# EAGLE design nrfdongle (EAGLE 6.2)
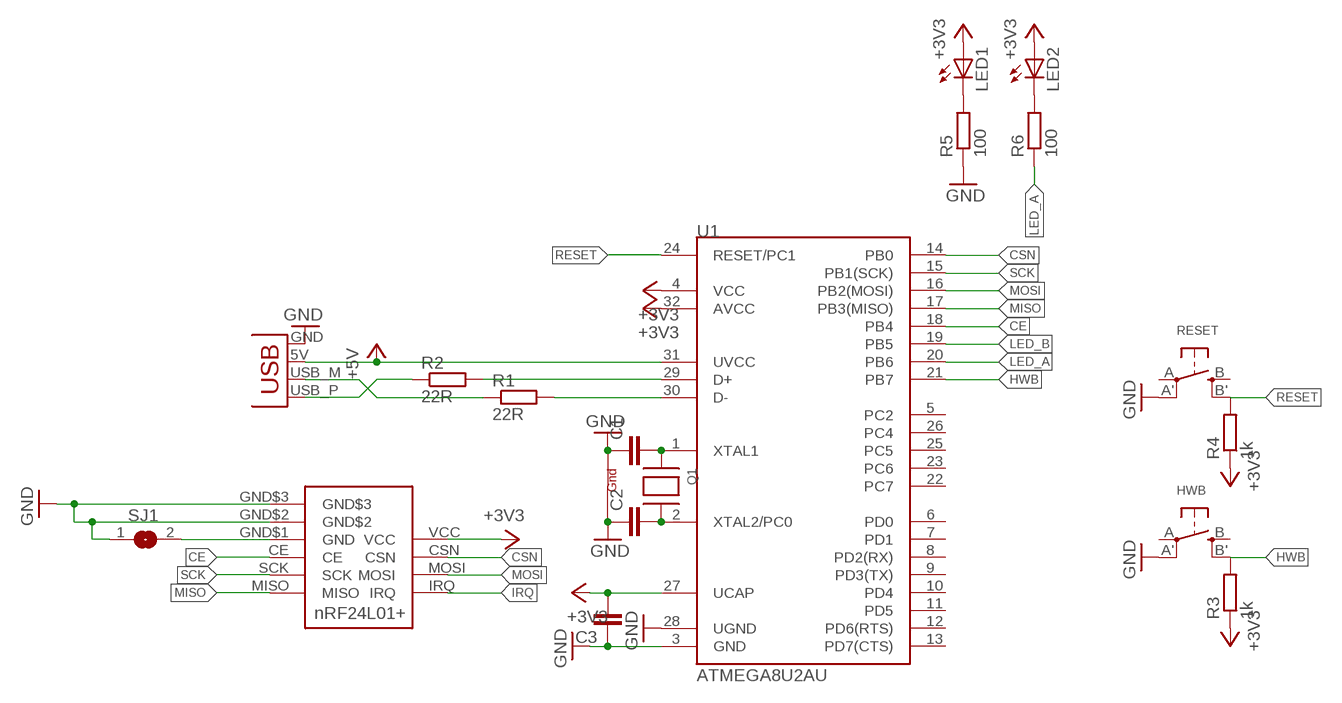
[diagram p0: schematic, sheet 1]

## Parts
C1  C-EUC0805  [C0805]
C2  C-EUC0805  [C0805]
C3  C-EUC0805  [C0805]
CHINESE1  NRF24L01+CHINESE-DUAL  [CHINESE-DUALPINOUT]
HWB  SWITCH_TACT_SMT  [EVQ-Q2]
LED1  LEDSML0805  [SML0805]
LED2  LEDSML0805  [SML0805]
Q1  XTAL-4-3225  [NX3225]
R1  22R  R-EU_R0805  [R0805]
R2  22R  R-EU_R0805  [R0805]
R3  1k  R-EU_R0805  [R0805]
R4  1k  R-EU_R0805  [R0805]
R5  100  R-EU_R0805  [R0805]
R6  100  R-EU_R0805  [R0805]
RESET  SWITCH_TACT_SMT  [EVQ-Q2]
SJ1  SJ  [SJ]
U1  ATMEGA8U2AU  [TQFP32-08]
X1  USBPCB  [USB-A-PCB]

## Nets
+3V3: C3.2 CHINESE1.VCC LED1.A LED2.A R3.1 R4.1 U1.4(VCC) U1.27(UCAP) U1.32(AVCC)
+5V: U1.31(UVCC) X1.5V(VBUS)
CE: CHINESE1.CE U1.18(PB4)
CSN: CHINESE1.CSN U1.14(PB0)
GND: C1.1 C2.1 C3.1 CHINESE1.GND$2 CHINESE1.GND$3 HWB.A'(P1) Q1.2(G1) Q1.4(G2) R5.1 RESET.A'(P1) SJ1.1 U1.3(GND) U1.28(UGND) X1.GND
HWB: HWB.B'(S1) R3.2 U1.21(PB7)
IRQ: CHINESE1.IRQ
LED_A: R6.1 U1.20(PB6)
LED_B: U1.19(PB5)
MISO: CHINESE1.MISO U1.17(PB3(MISO))
MOSI: CHINESE1.MOSI U1.16(PB2(MOSI))
N$1: R1.1 X1.USB_M(D-)
N$2: R2.1 X1.USB_P(D+)
N$3: R1.2 U1.30(D-)
N$4: R2.2 U1.29(D+)
N$5: CHINESE1.GND$1(GND) SJ1.2
N$6: C1.2 Q1.1(X1) U1.1(XTAL1)
N$7: C2.2 Q1.3(X2) U1.2(XTAL2/PC0)
N$8: LED1.C R5.2
N$9: LED2.C R6.2
RESET: R4.2 RESET.B'(S1) U1.24(RESET/PC1)
SCK: CHINESE1.SCK U1.15(PB1(SCK))
Unconnected: HWB.A(P) HWB.B(S) RESET.A(P) RESET.B(S) U1.5(PC2) U1.6(PD0) U1.7(PD1) U1.8(PD2(RX)) U1.9(PD3(TX)) U1.10(PD4) U1.11(PD5) U1.12(PD6(RTS)) U1.13(PD7(CTS)) U1.22(PC7) U1.23(PC6) U1.25(PC5) U1.26(PC4)

## Library data of the parts
C1-C3 = rcl:C-EU: CAPACITOR, European symbol
CHINESE1 = nrf24l01+:NRF24L01+: When using the DUAL version of this library, make sure to not connect pin 1 if you are using the 10 pin module.
HWB RESET = microbuilder:SWITCH_TACT_SMT: SMT Tact Switches 6x6mm - Digikey: P12940SCT-ND KMR2 (4.6x2.8mm) - Digikey: 401-1426-1-ND EVQ-PQHB55 - Light Touch, 160GF (4.5x4.5mm) - Digikey: P8090SCT-ND
LED1 LED2 = led:LED: LED OSRAM: - CHIPLED LG R971, LG N971, LY N971, LG Q971, LY Q971, LO R971, LY R971 LH N974, LH R974 LS Q976, LO Q976, LY Q976 LO Q996 - Hyper CHIPLED LW Q18S LB Q993, LB Q99A, LB R99A - SideLED LS A670, LO A670, LY A670, LG A670, LP A670 LB A673, LV A673, LT A673, LW A673 LH A674 LY A675 LS A676, LA A676, LO A676, LY A676, LW A676 LS A679, LY A679, LG A679 - Hyper Micro SIDELED® LS Y876, LA Y876, LO Y876, LY Y876 LT Y87S - SmartLED LW L88C, LW L88S LB L89C, LB L89S, LG L890 LS L89K, LO L89K, LY L89K LS L896, LA L896, LO L896, LY L896 - TOPLED LS T670, LO T670, LY T670, LG T670, LP T670 LSG T670, LSP T670, LSY T670, LOP T670, LYG T670 LG T671, LOG T671, LSG T671 LB T673, LV T673, LT T673, LW T673 LH T674 LS T676, LA T676, LO T676, LY T676, LB T676, LH T676, LSB T676, LW T676 LB T67C, LV T67C, LT T67C, LS T67K, LO T67K, LY T67K, LW E67C LS E67B, LA E67B, LO E67B, LY E67B, LB E67C, LV E67C, LT E67C LW T67C LS T679, LY T679, LG T679 LS T770, LO T770, LY T770, LG T770, LP T770 LB T773, LV T773, LT T773, LW T773 LH T774 LS E675, LA E675, LY E675, LS T675 LS T776, LA T776, LO T776, LY T776, LB T776 LHGB T686 LT T68C, LB T68C - Hyper Mini TOPLED® LB M676 - Mini TOPLED Santana® LG M470 LS M47K, LO M47K, LY M47K Source: http://www.osram.convergy.de LUXEON: - LUMILED® LXK2-PW12-R00, LXK2-PW12-S00, LXK2-PW14-U00, LXK2-PW14-V00 LXK2-PM12-R00, LXK2-PM12-S00, LXK2-PM14-U00 LXK2-PE12-Q00, LXK2-PE12-R00, LXK2-PE12-S00, LXK2-PE14-T00, LXK2-PE14-U00 LXK2-PB12-K00, LXK2-PB12-L00, LXK2-PB12-M00, LXK2-PB14-N00, LXK2-PB14-P00, LXK2-PB14-Q00 LXK2-PR12-L00, LXK2-PR12-M00, LXK2-PR14-Q00, LXK2-PR14-R00 LXK2-PD12-Q00, LXK2-PD12-R00, LXK2-PD12-S00 LXK2-PH12-R00, LXK2-PH12-S00 LXK2-PL12-P00, LXK2-PL12-Q00, LXK2-PL12-R00 Source: www.luxeon.com KINGBRIGHT: KA-3528ASYC Source: www.kingbright.com
Q1 = adafruit:XTAL-4: Classic 4-pin 3.2 x 2.5mm crystal
R1-R6 = rcl:R-EU_: RESISTOR, European symbol
SJ1 = jumper:SJ: SMD solder JUMPER
U1 = SparkFun:ATMEGA8U2: Atmel 8-bit Microcontroller with 8/16/32K Bystes of ISP Flash and USB Controller. ATmega8U2, ATmega16U2, and ATmega32U2
X1 = SparkFun:USB: USB Connectors USB-B-PTH is fully proven SKU : PRT-00139 USB-miniB is fully proven SKU : PRT-00587 USB-A-PCB is untested. USB-A-H is throughly reviewed, but untested. Spark Fun Electronics SKU : PRT-00437 USB-B-SMT is throughly reviewed, but untested. Needs silkscreen touching up. USB-A-S has not been used/tested USB-MB-H has not been used/tested

## Board
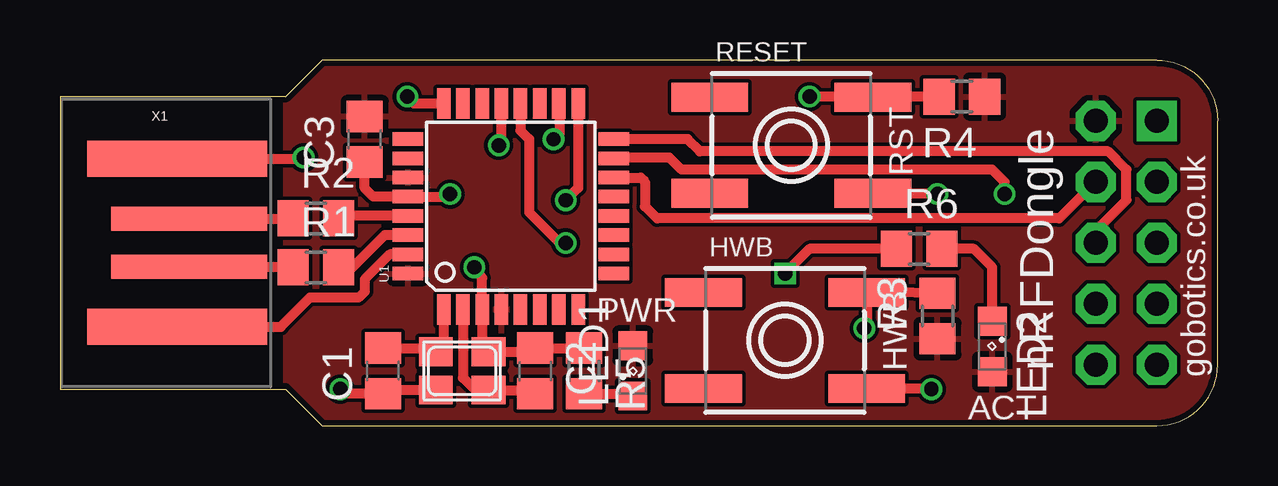
[diagram p1: board, top side]
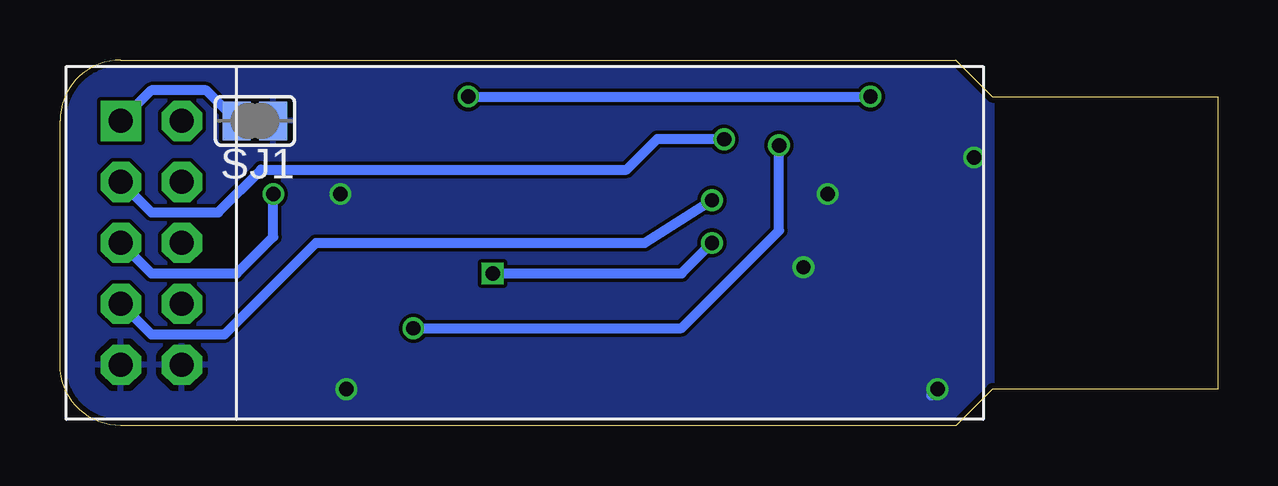
[diagram p2: board, bottom side, seen from below]

Size 48.26 x 15.24 mm. Coordinates in mm from the lower left corner, seen from the top.
Outline: 10.92,0 45.72,0 arc90 48.26,2.54 48.26,12.7 arc90 45.72,15.24 10.92,15.24 9.4,13.72 0,13.72 0,1.52 9.4,1.52 10.92,0
Copper layers (1*16): Top 0.035mm / dielectric 1.5mm / Bottom 0.035mm
Design rules: minimum track width 6mil, minimum drill 12mil, track to track 6mil, track to pad 6mil, pad to pad 6mil, via to via 6mil, smd to smd 0mil, copper to edge 10mil, drill to drill 10mil, minimum pad ring 10mil, minimum via ring 6mil, stop-mask expansion 2mil, vias tented up to drill 100mil, thermal gap 10mil

### Footprints (pad centres in the part's own frame; a part is rotated, then mirrored left to right if it is on the bottom)
C0805 = smd 1.3 x 1.5: 1 -0.95,0; 2 0.95,0
CHINESE-DUALPINOUT = drill 1 pad 1.676 octagon: CE -10.16,0; CSN -7.62,0; GND$2 -10.16,-7.62; GND$3 -7.62,-7.62; IRQ -7.62,-5.08; MISO -10.16,-5.08; MOSI -7.62,-2.54; SCK -10.16,-2.54; VCC -7.62,2.54 | drill 1 pad 1.676 square: GND$1 -10.16,2.54
EVQ-Q2 = smd 3.2 x 1.2: A -3.4,-2; A' 3.4,-2; B -3.4,2; B' 3.4,2
SML0805 = smd 1.2 x 1.2: A 1.05,0; C -1.05,0
NX3225 = smd 1.4 x 1.2: 1 -1.1,0.8; 2 1.1,0.8; 3 1.1,-0.8; 4 -1.1,-0.8
R0805 = smd 1.3 x 1.5: 1 -0.95,0; 2 0.95,0
SJ = smd 1.168 x 1.6: 1 -0.762,0; 2 0.762,0
TQFP32-08 = smd 1.27 x 0.559: 1 -4.293,2.8; 2 -4.293,2; 3 -4.293,1.2; 4 -4.293,0.4; 5 -4.293,-0.4; 6 -4.293,-1.2; 7 -4.293,-2; 8 -4.293,-2.8; 17 4.293,-2.8; 18 4.293,-2; 19 4.293,-1.2; 20 4.293,-0.4; 21 4.293,0.4; 22 4.293,1.2; 23 4.293,2; 24 4.293,2.8 | smd 0.559 x 1.27: 9 -2.8,-4.293; 10 -2,-4.293; 11 -1.2,-4.293; 12 -0.4,-4.293; 13 0.4,-4.293; 14 1.2,-4.293; 15 2,-4.293; 16 2.8,-4.293; 25 2.8,4.293; 26 2,4.293; 27 1.2,4.293; 28 0.4,4.293; 29 -0.4,4.293; 30 -1.2,4.293; 31 -2,4.293; 32 -2.8,4.293
USB-A-PCB = smd 7.5 x 1.5: 5V -0.2,-3.5; GND -0.2,3.5 | smd 6.5 x 1: USB_M 0.3,-1; USB_P 0.3,1

### Placement (x,y rotation side)
C1  13.46,2.29 90 top
C2  19.81,2.29 270 top
C3  12.7,11.94 90 top
CHINESE1  35.56,10.16 0 bottom
HWB  30.23,3.56 0 top
LED1  23.88,2.29 90 top
LED2  38.86,3.3 270 top
Q1  16.76,2.29 0 top
R1  10.67,6.6 0 top
R2  10.67,8.64 0 top
R3  36.58,4.57 90 top
R4  37.59,13.72 180 top
R5  21.84,2.29 270 top
R6  35.81,7.37 0 top
RESET  30.48,11.68 0 top
SJ1  40.13,12.7 180 bottom
U1  18.8,9.14 90 top
X1  5.08,7.62 0 top

### Tracks (layer width: path | path; a pad name or v marks a point on that pad's centre or on a via)
+3V3
  pour Top: 10.16,18.03 51.56,18.03 51.56,-3.56 9.4,-3.56 9.4,18.03
+5V
  Top 0.406: U1.31 13.75,7.14 12.7,6.1 12.7,5.59 12.45,5.33 10.41,5.33 9.2,4.12 X1.5V
CE  (via drill 0.6)
  Top 0.406: U1.18 20.83,13.4 20.83,12.19 v20.57,11.94
  Bottom 0.406: CHINESE1.CE 44.45,8.89 41.66,8.89 39.88,10.67 24.64,10.67 23.37,11.94 v20.57,11.94
CSN
  Top 0.406: CHINESE1.CSN 41.66,8.64 24.89,8.64 24.38,9.14 24.38,10.16 24.2,10.34 U1.14
GND  (via drill 0.6)
  Top 0.406: X1.GND 10.1,11.12 v10.16,11.18 | v16.26,9.65 16.15,9.54 U1.28 13.06,9.54 12.7,9.91 C3.1 | v17.27,6.6 17.6,6.17 U1.3 17.6,3.58 Q1.2 19.66,3.09 C2.1 R5.1 | v11.68,1.52 11.87,1.34 C1.1 13.36,1.49 Q1.4 | HWB.A' 36.29,1.56 v36.32,1.52 | RESET.A' 36.54,9.68 v36.58,9.65
  Bottom 0.406: v10.16,11.18 9.91,11.18 | v16.26,9.65 16,9.65 | v11.68,1.52 11.94,1.27 | v36.32,1.52 36.07,1.52 | v36.58,9.65 36.32,9.65
  pour Bottom: 9.4,17.02 50.04,17.02 50.04,-2.54 9.4,-2.54
HWB  (via drill 0.6)
  Top 0.406: R3.2 33.66,5.59 HWB.B' 33.63,4.16 v33.53,4.06 | v18.29,11.68 18.4,11.79 U1.21
  Bottom 0.406: v33.53,4.06 22.35,4.06 18.29,8.13 v18.29,11.68
LED_A  (via drill 0.6)
  Top 0.406: R6.1 31.24,7.37 v30.23,6.35 | v21.08,7.62 20.83,7.62 19.56,8.89 19.56,11.94 19.2,12.3 U1.20
  Bottom 0.406: v30.23,6.35 22.35,6.35 v21.08,7.62
MISO  (via drill 0.6)
  Top 0.406: U1.17 21.6,9.91 v21.08,9.4
  Bottom 0.406: CHINESE1.MISO 44.45,3.81 41.4,3.81 37.59,7.62 23.88,7.62 v21.08,9.4
MOSI
  Top 0.406: CHINESE1.MOSI 43.18,8.13 44.45,9.4 44.45,10.67 43.69,11.43 26.67,11.43 26.16,11.94 U1.16
N$1
  Top 0.406: X1.USB_M 9.7,6.62 R1.1
N$2
  Top 0.406: X1.USB_P 9.7,8.62 R2.1
N$3
  Top 0.406: U1.30 13.53,7.94 12.19,6.6 R1.2
N$4
  Top 0.406: U1.29 11.73,8.74 R2.2
N$5
  Bottom 0.406: SJ1.2 42.16,13.97 44.45,13.97 CHINESE1.GND$1
N$6
  Top 0.406: C1.2 15.51,3.24 Q1.1 16,3.42 U1.1
N$7
  Top 0.406: U1.2 16.8,2 17.27,1.52 17.83,1.52 Q1.3 19.66,1.49 C2.2
N$8
  Top 0.406: R5.2 23.78,1.34 LED1.C
N$9
  Top 0.406: LED2.C 38.86,6.6 38.1,7.37 R6.2
RESET  (via drill 0.6)
  Top 0.406: R4.2 33.91,13.72 RESET.B' 33.85,13.72 v31.24,13.72 | v14.48,13.72 14.76,13.44 U1.24
  Bottom 0.406: v31.24,13.72 v14.48,13.72
SCK  (via drill 0.6)
  Top 0.406: v39.37,9.65 39.37,10.16 38.86,10.67 25.91,10.67 25.4,11.18 23.12,11.18 U1.15
  Bottom 0.406: CHINESE1.SCK 44.45,6.35 40.89,6.35 39.37,7.87 v39.37,9.65

### Text on the board
_tsilk: RST | PWR | HWB | nRFDongle | gobotics.co.uk | ACT